# Altium schematic sheet ASBB_ADC.SchDoc
size A4
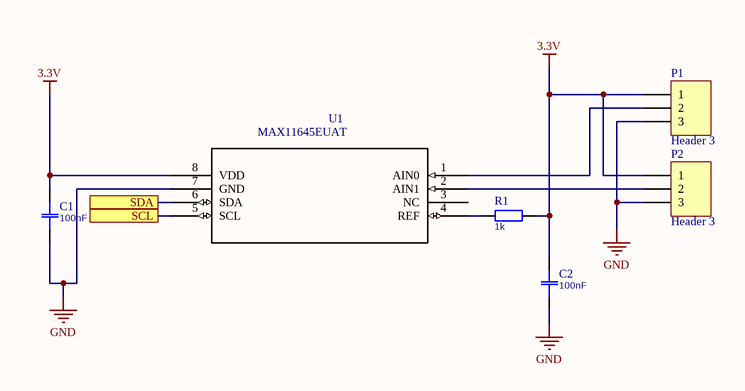
[diagram p0: ASBB_ADC.SchDoc]

## Parts
C1  100nF  [0603]
C2  100nF  [0603]
P1  Header 3  [HDR1X3]
P2  Header 3  [HDR1X3]
R1  1k  [0603]
U1  MAX11645EUAT  [21-0036K]

## Ports
SCL, SDA

## Nets
3.3V: C1.1 C2.1 P1.1 P2.1 R1.1 U1.8(VDD)
GND: C1.2 C2.2 P1.3 P2.3 U1.7(GND)
SCL: U1.5(SCL) ; port SCL
SDA: U1.6(SDA) ; port SDA
NetP1_2: P1.2 U1.1(AIN0)
NetP2_2: P2.2 U1.2(AIN1)
NetR1_2: R1.2 U1.4(REF)

Not connected (* = marked no-connect by the designer): U1 3(NC)

## Library data of the parts
C1 C2 = Capacitor: Partnumber: ?; Value: ?
P1 P2 = Header 3: Header, 3-Pin; LatestRevisionDate: 17-Jul-2002; LatestRevisionNote: Re-released for DXP Platform.; Publisher: Altium Limited
R1 = Resistor: Partnumber: ?; Value: ?
U1 = MAX11645EUAT: Data acquisition IC - AD converter _ADC_ Maxim Integrated MAX11645EUA+ External , Internal uMAX 8; Digi-Key_Purchase_URL: https://www.digikey.de/product-detail/en/maxim-integrated/MAX11645EUA-/MAX11645EUA--ND/2349323?utm_source=snapeda&utm_medium=aggregator&utm_campaign=symbol; MF: Maxim Integrated; Digi-Key_Part_Number: MAX11645EUA+-ND; SnapEDA_Link: https://www.snapeda.com/parts/MAX11645EUA%2B/Maxim%20Integrated/view-part/?ref=snap; Package: MSOP-8 Maxim Integrated; MP: MAX11645EUA+; Value: *